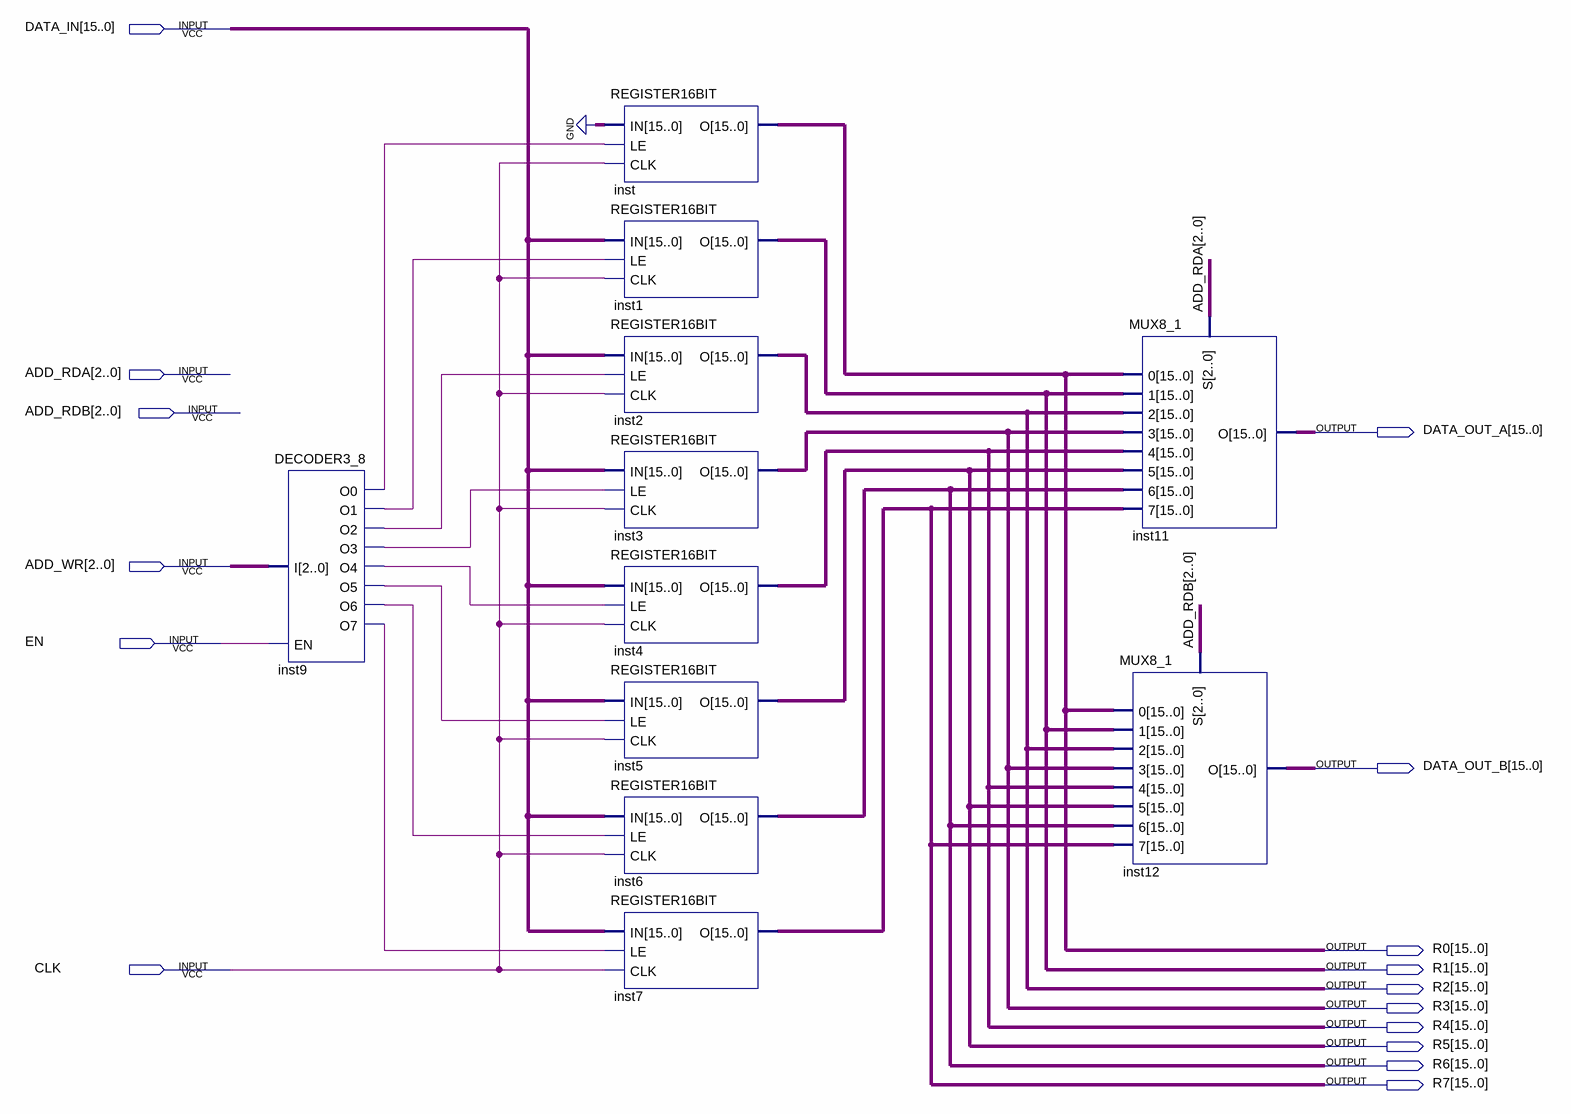
[diagram p0: schematic sheet]
// Quartus schematic TEST_RF.bdf as structural Verilog: 11 symbols, 16 pins
module TEST_RF (
  input  [15:0] DATA_IN,
  input  [2:0] ADD_RDA,
  input  [2:0] ADD_RDB,
  input  [2:0] ADD_WR,
  input  EN,
  input  CLK,
  output [15:0] DATA_OUT_A,
  output [15:0] DATA_OUT_B,
  output [15:0] R0,
  output [15:0] R1,
  output [15:0] R2,
  output [15:0] R3,
  output [15:0] R4,
  output [15:0] R5,
  output [15:0] R6,
  output [15:0] R7
);

  wire inst9_o0, inst9_o1, inst9_o2, inst9_o3, inst9_o4, inst9_o5, inst9_o6, inst9_o7;

  DECODER3_8 inst9 (
    .EN(EN), .I(ADD_WR), .O0(inst9_o0), .O1(inst9_o1), .O2(inst9_o2), .O3(inst9_o3), .O4(inst9_o4),
    .O5(inst9_o5), .O6(inst9_o6), .O7(inst9_o7));
  REGISTER16BIT inst (.IN({16{1'b0}}), .LE(inst9_o0), .CLK(CLK), .O(R0));
  REGISTER16BIT inst1 (.IN(DATA_IN), .LE(inst9_o1), .CLK(CLK), .O(R1));
  REGISTER16BIT inst2 (.IN(DATA_IN), .LE(inst9_o2), .CLK(CLK), .O(R2));
  REGISTER16BIT inst3 (.IN(DATA_IN), .LE(inst9_o3), .CLK(CLK), .O(R3));
  REGISTER16BIT inst4 (.IN(DATA_IN), .LE(inst9_o4), .CLK(CLK), .O(R4));
  REGISTER16BIT inst5 (.IN(DATA_IN), .LE(inst9_o5), .CLK(CLK), .O(R5));
  REGISTER16BIT inst6 (.IN(DATA_IN), .LE(inst9_o6), .CLK(CLK), .O(R6));
  REGISTER16BIT inst7 (.IN(DATA_IN), .LE(inst9_o7), .CLK(CLK), .O(R7));
  MUX8_1 inst11 (
    .S(ADD_RDA), .\0 (R0), .\1 (R1), .\2 (R2), .\3 (R3), .\4 (R4), .\5 (R5), .\6 (R6), .\7 (R7),
    .O(DATA_OUT_A));
  MUX8_1 inst12 (
    .S(ADD_RDB), .\0 (R0), .\1 (R1), .\2 (R2), .\3 (R3), .\4 (R4), .\5 (R5), .\6 (R6), .\7 (R7),
    .O(DATA_OUT_B));
endmodule
